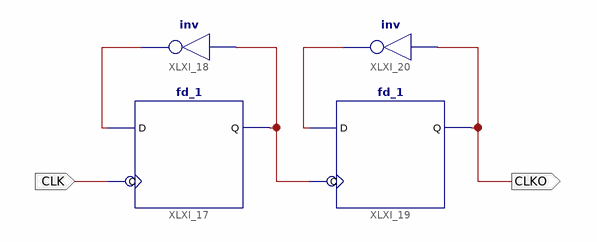
[diagram p0: schematic sheet 1]
// Xilinx ISE schematic clkdiv4.sch (spartan6) as structural Verilog: 4 symbols, 2 ports
module clkdiv4 (
  input  CLK,
  output CLKO
);

  wire XLXN_27, XLXN_29, XLXN_9999;

  fd_1 XLXI_17 (.C(CLK), .D(XLXN_27), .Q(XLXN_9999));
  not XLXI_18 (XLXN_27, XLXN_9999);
  fd_1 XLXI_19 (.C(XLXN_9999), .D(XLXN_29), .Q(CLKO));
  not XLXI_20 (XLXN_29, CLKO);
endmodule
